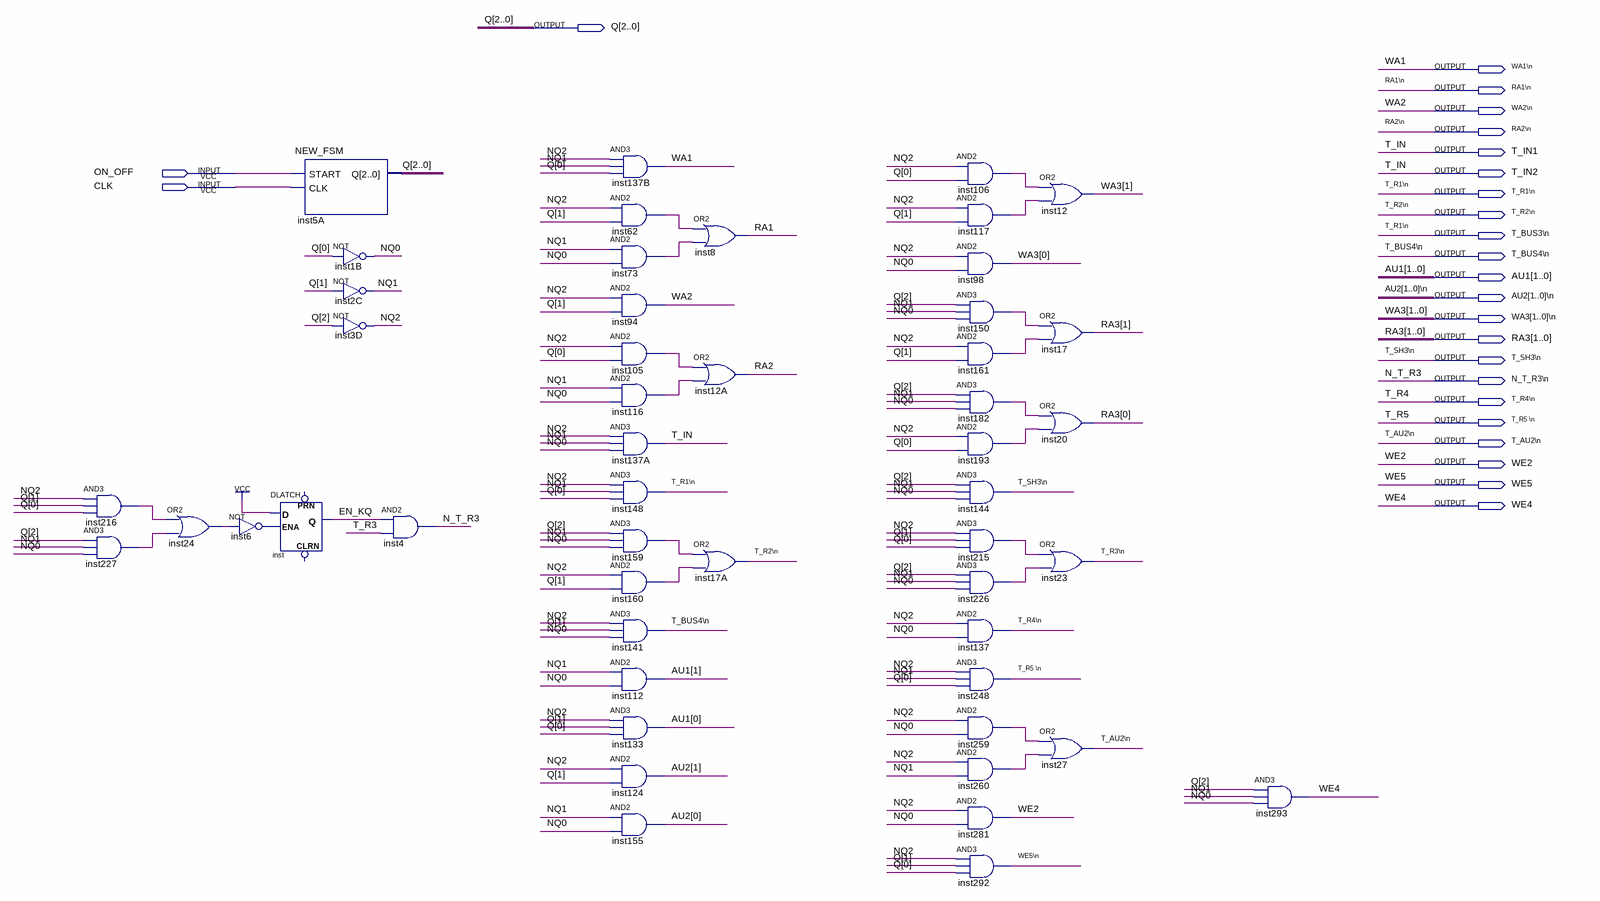
[diagram p0: schematic sheet]
// Quartus schematic CONTROLLER.bdf as structural Verilog: 50 symbols, 25 pins
module CONTROLLER (
  input  ON_OFF,
  input  CLK,
  output [2:0] Q,
  output \WA1\n ,
  output \RA1\n ,
  output \WA2\n ,
  output \RA2\n ,
  output T_IN1,
  output T_IN2,
  output \T_R1\n ,
  output \T_R2\n ,
  output \T_BUS3\n ,
  output \T_BUS4\n ,
  output [1:0] AU1,
  output \AU2[1..0]\n ,
  output \WA3[1..0]\n ,
  output [1:0] RA3,
  output \T_SH3\n ,
  output \N_T_R3\n ,
  output \T_R4\n ,
  output \T_R5_\n ,
  output \T_AU2\n ,
  output WE2,
  output WE5,
  output WE4
);

  wire EN_KQ, inst6_out, inst24_out, inst62_out, inst73_out, inst105_out, inst106_out, inst116_out,
       inst117_out, inst150_out, inst159_out, inst160_out, inst161_out, inst182_out, inst193_out,
       inst215_out, inst216_out, inst226_out, inst227_out, inst259_out, inst260_out, NQ0, NQ1, NQ2, RA1, RA2,
       T_R3, \T_R3\n , \WE5\n ;
  wire [1:0] AU2, WA3;

  and inst216 (inst216_out, NQ2, Q[1], Q[0]);
  and inst227 (inst227_out, Q[2], NQ1, NQ0);
  or inst24 (inst24_out, inst216_out, inst227_out);
  not inst6 (inst6_out, inst24_out);
  NEW_FSM inst5A (.START(ON_OFF), .CLK(CLK), .Q(Q));
  DLATCH inst (.D(1'b1), .ENA(inst6_out), .Q(EN_KQ));  // open: CLRN, PRN
  not inst1B (NQ0, Q[0]);
  not inst2C (NQ1, Q[1]);
  not inst3D (NQ2, Q[2]);
  and inst4 (\N_T_R3\n , EN_KQ, T_R3);
  and inst137B (\WA1\n , NQ2, NQ1, Q[0]);
  and inst62 (inst62_out, NQ2, Q[1]);
  and inst73 (inst73_out, NQ1, NQ0);
  and inst94 (\WA2\n , NQ2, Q[1]);
  and inst105 (inst105_out, NQ2, Q[0]);
  and inst116 (inst116_out, NQ1, NQ0);
  and inst137A (T_IN1, NQ2, NQ1, NQ0);
  and inst148 (\T_BUS3\n , NQ2, NQ1, Q[0]);
  and inst159 (inst159_out, Q[2], NQ1, NQ0);
  and inst160 (inst160_out, NQ2, Q[1]);
  and inst141 (\T_BUS4\n , NQ2, Q[1], NQ0);
  and inst112 (AU1[1], NQ1, NQ0);
  and inst133 (AU1[0], NQ2, Q[1], Q[0]);
  and inst124 (AU2[1], NQ2, Q[1]);
  and inst155 (AU2[0], NQ1, NQ0);
  or inst8 (RA1, inst62_out, inst73_out);
  or inst12A (RA2, inst105_out, inst116_out);
  or inst17A (\T_R2\n , inst159_out, inst160_out);
  and inst106 (inst106_out, NQ2, Q[0]);
  and inst117 (inst117_out, NQ2, Q[1]);
  and inst98 (WA3[0], NQ2, NQ0);
  and inst150 (inst150_out, Q[2], NQ1, NQ0);
  and inst161 (inst161_out, NQ2, Q[1]);
  and inst182 (inst182_out, Q[2], NQ1, NQ0);
  and inst193 (inst193_out, NQ2, Q[0]);
  and inst144 (\T_SH3\n , Q[2], NQ1, NQ0);
  and inst215 (inst215_out, NQ2, Q[1], Q[0]);
  and inst226 (inst226_out, Q[2], NQ1, NQ0);
  and inst137 (\T_R4\n , NQ2, NQ0);
  and inst248 (\T_R5_\n , NQ2, NQ1, Q[0]);
  and inst259 (inst259_out, NQ2, NQ0);
  and inst260 (inst260_out, NQ2, NQ1);
  and inst281 (WE2, NQ2, NQ0);
  and inst292 (\WE5\n , NQ2, Q[1], Q[0]);
  or inst12 (WA3[1], inst106_out, inst117_out);
  or inst17 (RA3[1], inst150_out, inst161_out);
  or inst20 (RA3[0], inst182_out, inst193_out);
  or inst23 (\T_R3\n , inst215_out, inst226_out);
  or inst27 (\T_AU2\n , inst259_out, inst260_out);
  and inst293 (WE4, Q[2], NQ1, NQ0);

  assign T_IN2 = T_IN1;
  assign \T_R1\n  = \T_BUS3\n ;

  // Other names for the same wires on the sheet: N_T_R3 = \N_T_R3\n ; T_IN = T_IN1; T_R4 = \T_R4\n ; T_R5 = \T_R5_\n ;
  //   WA1 = \WA1\n ; WA2 = \WA2\n 
endmodule
